# Altium schematic sheet 3_MCU_Main.SchDoc: OBDH MCU Main
size A3; DrawnBy: Sara Vega /Matheus Frata; Revision: V2.1; SheetNumber: 3; SheetTotal: 7
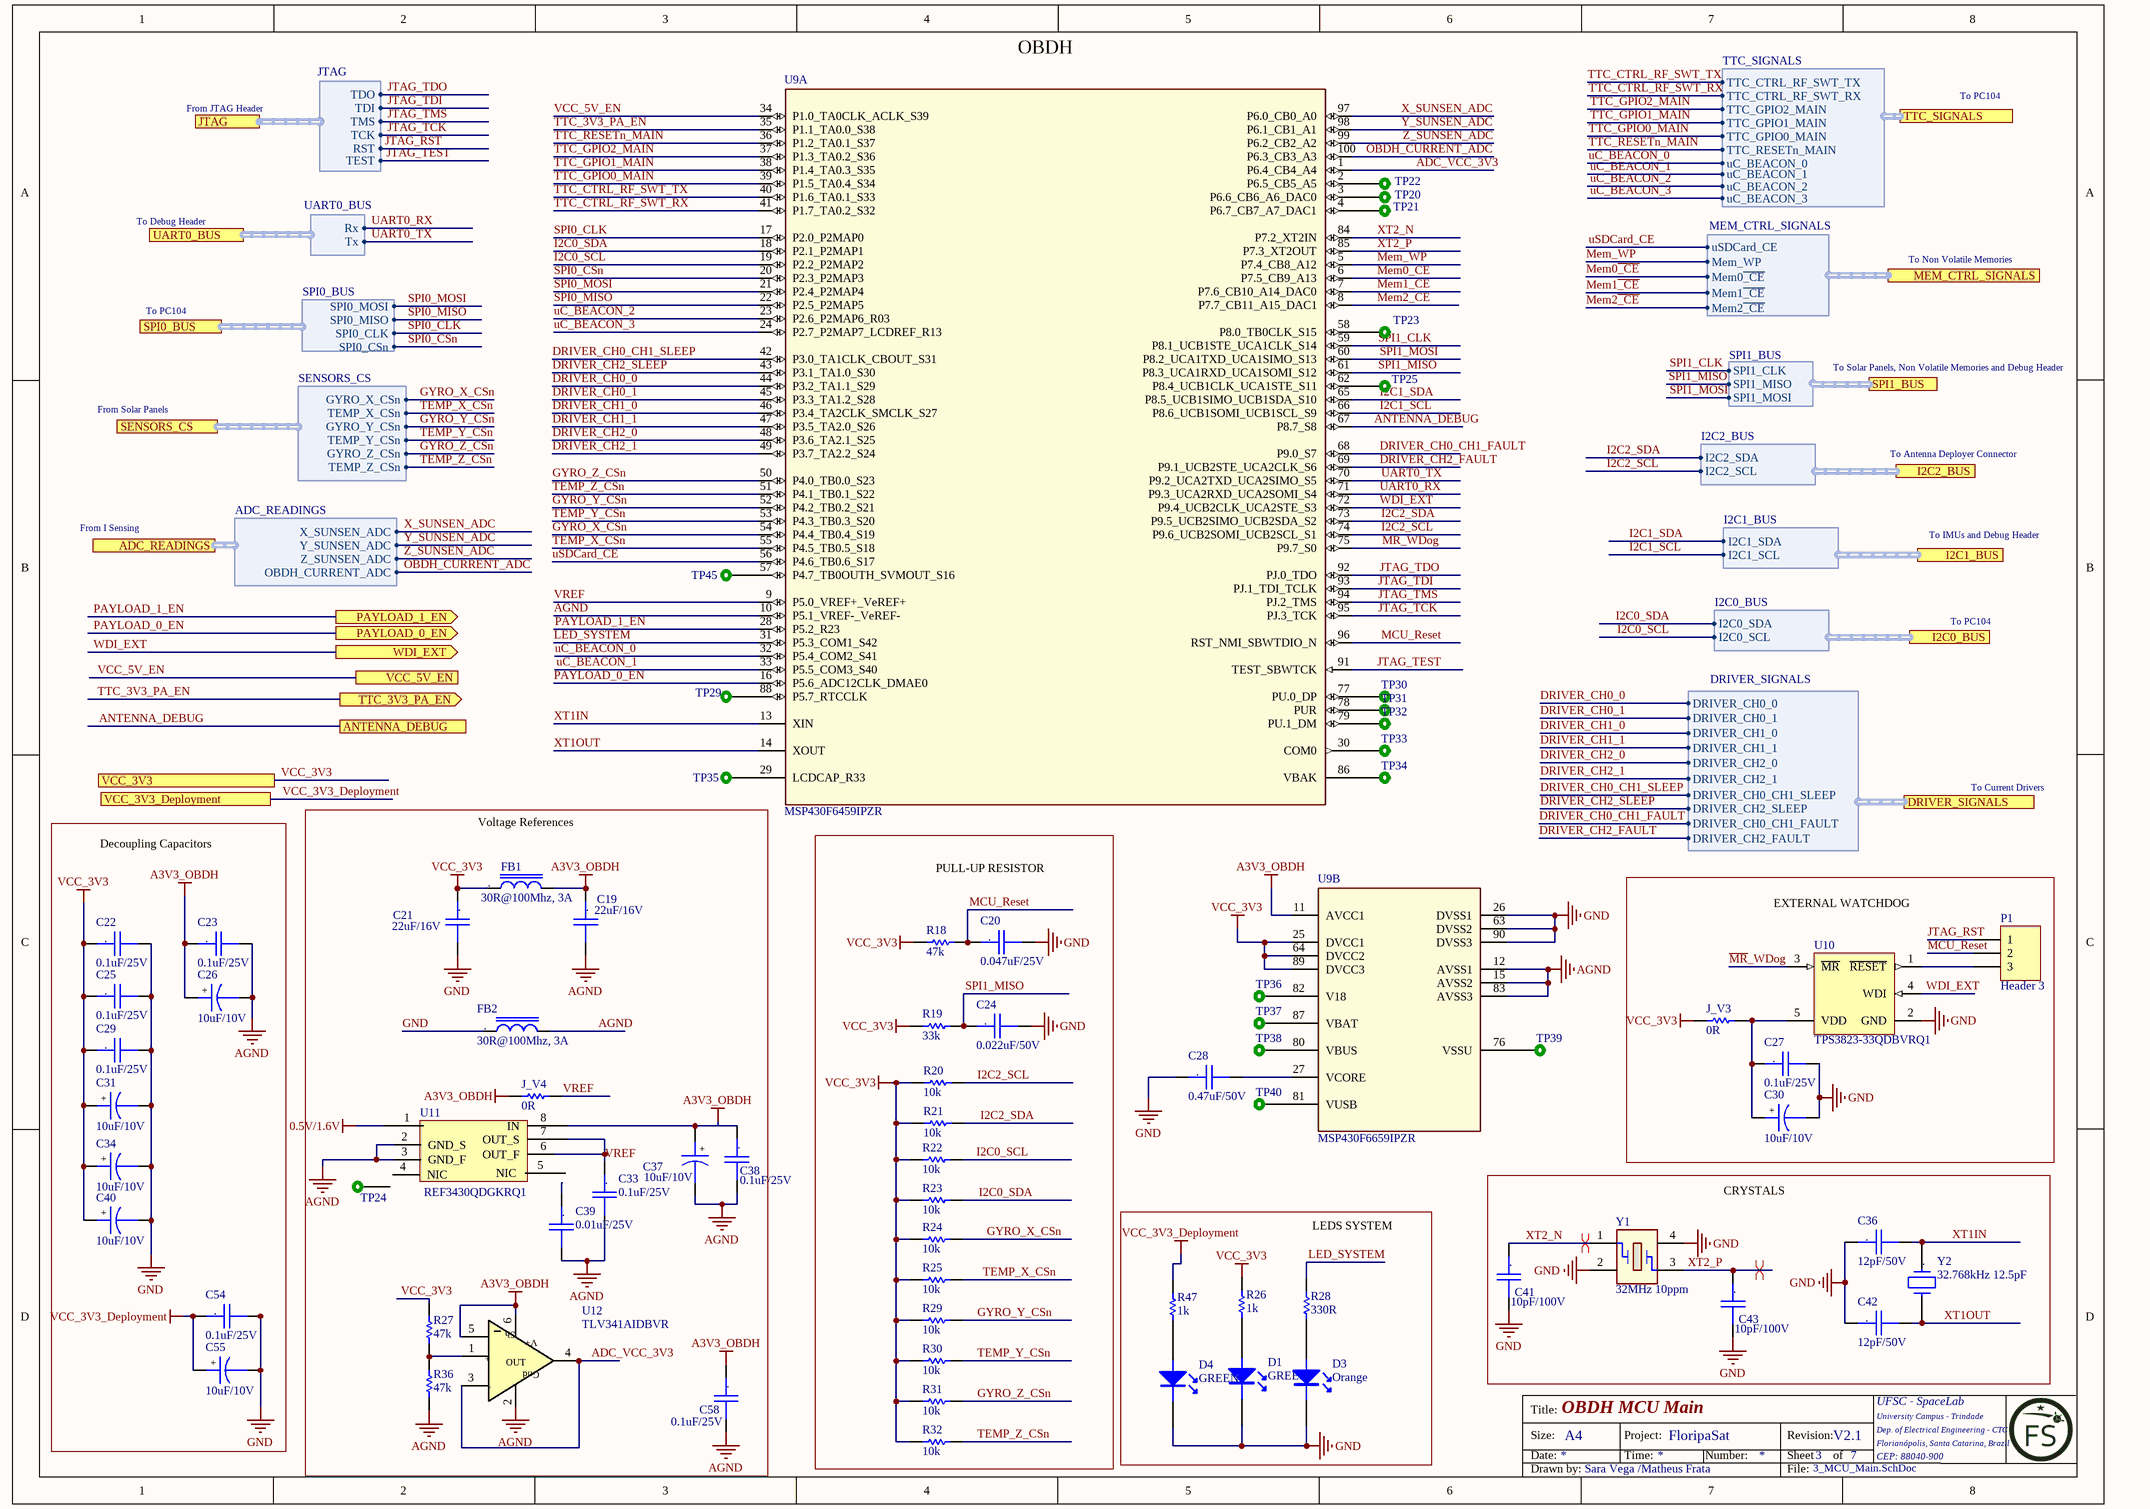
[diagram p0: 3_MCU_Main.SchDoc]

## Parts
C19  22uF/16V  [CC1210]
C20  0.047uF/25V  [CC0805]
C21  22uF/16V  [CC1210]
C22  0.1uF/25V  [CC0805]
C23  0.1uF/25V  [CC0805]
C24  0.022uF/50V  [CC0805]
C25  0.1uF/25V  [CC0805]
C26  10uF/10V  [CC0805_Tantalum]
C27  0.1uF/25V  [CC0805]
C28  0.47uF/50V  [CC0805]
C29  0.1uF/25V  [CC0805]
C30  10uF/10V  [CC0805_Tantalum]
C31  10uF/10V  [CC0805_Tantalum]
C33  0.1uF/25V  [CC0805]
C34  10uF/10V  [CC0805_Tantalum]
C36  12pF/50V  [CC0805]
C37  10uF/10V  [CC0805_Tantalum]
C38  0.1uF/25V  [CC0805]
C39  0.01uF/25V  [CC0805]
C40  10uF/10V  [CC0805_Tantalum]
C41  10pF/100V  [CC0805]
C42  12pF/50V  [CC0805]
C43  10pF/100V  [CC0805]
C54  0.1uF/25V  [CC0805]
C55  10uF/10V  [CC0805_Tantalum]
C58  0.1uF/25V  [CC0805]
D1  GREEN  [0805-LED]
D3  Orange  [0805-LED]
D4  GREEN  [0805-LED]
FB1  30R@100Mhz, 3A  [IND0805]
FB2  30R@100Mhz, 3A  [IND0805]
J_V3  0R  [0805]
J_V4  0R  [0805]
P1  Header 3  [HDR1X3]
R18  47k  [0805]
R19  33k  [0805]
R20  10k  [0805]
R21  10k  [0805]
R22  10k  [0805]
R23  10k  [0805]
R24  10k  [0805]
R25  10k  [0805]
R26  1k  [0805]
R27  47k  [0805]
R28  330R  [0805]
R29  10k  [0805]
R30  10k  [0805]
R31  10k  [0805]
R32  10k  [0805]
R36  47k  [0805]
R47  1k  [0805]
TP20  TEST_POINT_2  [TEST_POINT_2]  (value not drawn)  (no BOM)
TP21  TEST_POINT_2  [TEST_POINT_2]  (value not drawn)  (no BOM)
TP22  TEST_POINT_2  [TEST_POINT_2]  (value not drawn)  (no BOM)
TP23  TEST_POINT_2  [TEST_POINT_2]  (value not drawn)  (no BOM)
TP24  TEST_POINT_2  [TEST_POINT_2]  (value not drawn)  (no BOM)
TP25  TEST_POINT_2  [TEST_POINT_2]  (value not drawn)  (no BOM)
TP29  TEST_POINT_2  [TEST_POINT_2]  (value not drawn)  (no BOM)
TP30  TEST_POINT_2  [TEST_POINT_2]  (value not drawn)  (no BOM)
TP31  TEST_POINT_2  [TEST_POINT_2]  (value not drawn)  (no BOM)
TP32  TEST_POINT_2  [TEST_POINT_2]  (value not drawn)  (no BOM)
TP33  TEST_POINT_2  [TEST_POINT_2]  (value not drawn)  (no BOM)
TP34  TEST_POINT_2  [TEST_POINT_2]  (value not drawn)  (no BOM)
TP35  TEST_POINT_2  [TEST_POINT_2]  (value not drawn)  (no BOM)
TP36  TEST_POINT_2  [TEST_POINT_2]  (value not drawn)  (no BOM)
TP37  TEST_POINT_2  [TEST_POINT_2]  (value not drawn)  (no BOM)
TP38  TEST_POINT_2  [TEST_POINT_2]  (value not drawn)  (no BOM)
TP39  TEST_POINT_2  [TEST_POINT_2]  (value not drawn)  (no BOM)
TP40  TEST_POINT_2  [TEST_POINT_2]  (value not drawn)  (no BOM)
TP45  TEST_POINT_2  [TEST_POINT_2]  (value not drawn)  (no BOM)
U9  MSP430F6459IPZR  [PZ0100A_N]  (parts A,B of 2)
U10  TPS3823-33QDBVRQ1  [DBV0005A_N]
U11  REF3430QDGKRQ1  [SOIC-8]
U12  TLV341AIDBVR  [SOT-23 6L]
Y1  32MHz 10ppm  [XTAL_ABM8X]
Y2  32.768kHz 12.5pF  [ABS06 0805]

## Blocks framed on the sheet
Decoupling Capacitors: C22 C23 C25 C26 C29 C31 C34 C40 C54 C55
Voltage References: C19 C21 C33 C37-C39 C58 FB1 FB2 J_V4 R27 R36 TP24 U11 U12
PULL-UP RESISTOR: C20 C24 R18-R25 R29-R32
EXTERNAL WATCHDOG: C27 C30 J_V3 P1 U10
CRYSTALS: C36 C41-C43 Y1 Y2
LEDS SYSTEM: D1 D3 D4 R26 R28 R47

## Ports
ADC_READINGS (harness ADC_READINGS), ANTENNA_DEBUG, DRIVER_SIGNALS (harness DRIVER_SIGNALS), I2C0_BUS (harness I2C0_BUS), I2C1_BUS (harness I2C1_BUS), I2C2_BUS (harness I2C2_BUS), JTAG (harness JTAG), MEM_CTRL_SIGNALS (harness MEM_CTRL_SIGNALS), PAYLOAD_0_EN (out), PAYLOAD_1_EN (out), SENSORS_CS (harness SENSORS_CS), SPI0_BUS (harness SPI0_BUS), SPI1_BUS (harness SPI1_BUS), TTC_3V3_PA_EN (out), TTC_SIGNALS (harness TTC_SIGNALS), UART0_BUS (harness UART0_BUS), VCC_3V3, VCC_3V3_Deployment, VCC_5V_EN, WDI_EXT (out)

## Harnesses
JTAG: TDO, TDI, TMS, TCK, RST, TEST
UART0_BUS: Rx, Tx
I2C1_BUS: I2C1_SCL, I2C1_SDA
SENSORS_CS: GYRO_X_CSn, TEMP_X_CSn, GYRO_Y_CSn, TEMP_Y_CSn, GYRO_Z_CSn, TEMP_Z_CSn
I2C0_BUS: I2C0_SCL, I2C0_SDA
I2C2_BUS: I2C2_SCL, I2C2_SDA
DRIVER_SIGNALS: DRIVER_CH0_CH1_SLEEP, DRIVER_CH2_SLEEP, DRIVER_CH0_CH1_FAULT, DRIVER_CH2_FAULT, DRIVER_CH2_1, DRIVER_CH2_0, DRIVER_CH1_1, DRIVER_CH1_0, DRIVER_CH0_1, DRIVER_CH0_0
TTC_SIGNALS: TTC_RESETn_MAIN, TTC_GPIO0_MAIN, TTC_GPIO1_MAIN, TTC_GPIO2_MAIN, TTC_CTRL_RF_SWT_RX, TTC_CTRL_RF_SWT_TX, uC_BEACON_0, uC_BEACON_1, uC_BEACON_2, uC_BEACON_3
ADC_READINGS: OBDH_CURRENT_ADC, Z_SUNSEN_ADC, Y_SUNSEN_ADC, X_SUNSEN_ADC
MEM_CTRL_SIGNALS: Mem2~{_CE}, Mem1~{_CE}, Mem0~{_CE}, Mem_WP, uSDCard_CE
SPI0_BUS: SPI0_CLK, SPI0_MISO, SPI0_MOSI, SPI0_CSn
SPI1_BUS: SPI1_CLK, SPI1_MISO, SPI1_MOSI

## Nets
0.5V/1.6V: U11.1
A3V3_OBDH: C19.1 C23.1 C26.1 C58.1 FB1.2 J_V4.2 U9.11(AVCC1) U12.5(EN) U12.6(V+)
AGND: C19.2 C23.2 C26.2 C33.2 C37.2 C38.2 C39.2 C58.2 FB2.2 R36.2 U9.10(P5.1_VREF-_VeREF-) U9.12(AVSS1) U9.15(AVSS2) U9.83(AVSS3) U11.2(GND_S) U11.3(GND_F) U12.2(Gnd)
GND: C20.2 C21.2 C22.2 C24.2 C25.2 C27.2 C28.1 C29.2 C30.2 C31.2 C34.2 C36.1 C40.2 C41.2 C42.1 C43.2 C54.2 C55.2 D1.2(K) D3.2(K) D4.2(K) FB2.1 U9.26(DVSS1) U9.63(DVSS2) U9.90(DVSS3) U10.2(GND) Y1.2 Y1.4
VCC_3V3: C21.1 C22.1 C25.1 C29.1 C31.1 C34.1 C40.1 FB1.1 J_V3.2 R18.2 R19.2 R20.2 R21.2 R22.2 R23.2 R24.2 R25.2 R26.2 R27.1 R29.2 R30.2 R31.2 R32.2 U9.25(DVCC1) U9.64(DVCC2) U9.89(DVCC3) ; port VCC_3V3
VCC_3V3_Deployment: C54.1 C55.1 R47.2 ; port VCC_3V3_Deployment
~{MR}_WDog: U9.75(P9.7_S0) U10.3(~{MR})
ADC_VCC_3V3: U9.1(P6.4_CB4_A4) U12.3(-IN) U12.4(OUT)
ANTENNA_DEBUG: U9.67(P8.7_S8) ; port ANTENNA_DEBUG
DRIVER_CH0_0: U9.44(P3.2_TA1.1_S29) ; port DRIVER_SIGNALS.DRIVER_CH0_0
DRIVER_CH0_1: U9.45(P3.3_TA1.2_S28) ; port DRIVER_SIGNALS.DRIVER_CH0_1
DRIVER_CH0_CH1_FAULT: U9.68(P9.0_S7) ; port DRIVER_SIGNALS.DRIVER_CH0_CH1_FAULT
DRIVER_CH0_CH1_SLEEP: U9.42(P3.0_TA1CLK_CBOUT_S31) ; port DRIVER_SIGNALS.DRIVER_CH0_CH1_SLEEP
DRIVER_CH1_0: U9.46(P3.4_TA2CLK_SMCLK_S27) ; port DRIVER_SIGNALS.DRIVER_CH1_0
DRIVER_CH1_1: U9.47(P3.5_TA2.0_S26) ; port DRIVER_SIGNALS.DRIVER_CH1_1
DRIVER_CH2_0: U9.48(P3.6_TA2.1_S25) ; port DRIVER_SIGNALS.DRIVER_CH2_0
DRIVER_CH2_1: U9.49(P3.7_TA2.2_S24) ; port DRIVER_SIGNALS.DRIVER_CH2_1
DRIVER_CH2_FAULT: U9.69(P9.1_UCB2STE_UCA2CLK_S6) ; port DRIVER_SIGNALS.DRIVER_CH2_FAULT
DRIVER_CH2_SLEEP: U9.43(P3.1_TA1.0_S30) ; port DRIVER_SIGNALS.DRIVER_CH2_SLEEP
GYRO_X_CSn: R24.1 U9.54(P4.4_TB0.4_S19) ; port SENSORS_CS.GYRO_X_CSn
GYRO_Y_CSn: R29.1 U9.52(P4.2_TB0.2_S21) ; port SENSORS_CS.GYRO_Y_CSn
GYRO_Z_CSn: R31.1 U9.50(P4.0_TB0.0_S23) ; port SENSORS_CS.GYRO_Z_CSn
I2C0_SCL: R22.1 U9.19(P2.2_P2MAP2) ; port I2C0_BUS.I2C0_SCL
I2C0_SDA: R23.1 U9.18(P2.1_P2MAP1) ; port I2C0_BUS.I2C0_SDA
I2C1_SCL: U9.66(P8.6_UCB1SOMI_UCB1SCL_S9) ; port I2C1_BUS.I2C1_SCL
I2C1_SDA: U9.65(P8.5_UCB1SIMO_UCB1SDA_S10) ; port I2C1_BUS.I2C1_SDA
I2C2_SCL: R20.1 U9.74(P9.6_UCB2SOMI_UCB2SCL_S1) ; port I2C2_BUS.I2C2_SCL
I2C2_SDA: R21.1 U9.73(P9.5_UCB2SIMO_UCB2SDA_S2) ; port I2C2_BUS.I2C2_SDA
JTAG_RST: P1.1 ; port JTAG.RST
JTAG_TCK: U9.95(PJ.3_TCK) ; port JTAG.TCK
JTAG_TDI: U9.93(PJ.1_TDI_TCLK) ; port JTAG.TDI
JTAG_TDO: U9.92(PJ.0_TDO) ; port JTAG.TDO
JTAG_TEST: U9.91(TEST_SBWTCK) ; port JTAG.TEST
JTAG_TMS: U9.94(PJ.2_TMS) ; port JTAG.TMS
LED_SYSTEM: R28.1 U9.31(P5.3_COM1_S42)
MCU_Reset: C20.1 P1.2 R18.1 U9.96(RST_NMI_SBWTDIO_N)
Mem0~{_CE}: U9.6(P7.5_CB9_A13) ; port MEM_CTRL_SIGNALS.Mem0~{_CE}
Mem1~{_CE}: U9.7(P7.6_CB10_A14_DAC0) ; port MEM_CTRL_SIGNALS.Mem1~{_CE}
Mem2~{_CE}: U9.8(P7.7_CB11_A15_DAC1) ; port MEM_CTRL_SIGNALS.Mem2~{_CE}
Mem_WP: U9.5(P7.4_CB8_A12) ; port MEM_CTRL_SIGNALS.Mem_WP
OBDH_CURRENT_ADC: U9.100(P6.3_CB3_A3) ; port ADC_READINGS.OBDH_CURRENT_ADC
PAYLOAD_0_EN: U9.16(P5.6_ADC12CLK_DMAE0) ; port PAYLOAD_0_EN
PAYLOAD_1_EN: U9.28(P5.2_R23) ; port PAYLOAD_1_EN
SPI0_CLK: U9.17(P2.0_P2MAP0) ; port SPI0_BUS.SPI0_CLK
SPI0_CSn: U9.20(P2.3_P2MAP3) ; port SPI0_BUS.SPI0_CSn
SPI0_MISO: U9.22(P2.5_P2MAP5) ; port SPI0_BUS.SPI0_MISO
SPI0_MOSI: U9.21(P2.4_P2MAP4) ; port SPI0_BUS.SPI0_MOSI
SPI1_CLK: U9.59(P8.1_UCB1STE_UCA1CLK_S14) ; port SPI1_BUS.SPI1_CLK
SPI1_MISO: C24.1 R19.1 U9.61(P8.3_UCA1RXD_UCA1SOMI_S12) ; port SPI1_BUS.SPI1_MISO
SPI1_MOSI: U9.60(P8.2_UCA1TXD_UCA1SIMO_S13) ; port SPI1_BUS.SPI1_MOSI
TEMP_X_CSn: R25.1 U9.55(P4.5_TB0.5_S18) ; port SENSORS_CS.TEMP_X_CSn
TEMP_Y_CSn: R30.1 U9.53(P4.3_TB0.3_S20) ; port SENSORS_CS.TEMP_Y_CSn
TEMP_Z_CSn: R32.1 U9.51(P4.1_TB0.1_S22) ; port SENSORS_CS.TEMP_Z_CSn
TTC_3V3_PA_EN: U9.35(P1.1_TA0.0_S38) ; port TTC_3V3_PA_EN
TTC_CTRL_RF_SWT_RX: U9.41(P1.7_TA0.2_S32) ; port TTC_SIGNALS.TTC_CTRL_RF_SWT_RX
TTC_CTRL_RF_SWT_TX: U9.40(P1.6_TA0.1_S33) ; port TTC_SIGNALS.TTC_CTRL_RF_SWT_TX
TTC_GPIO0_MAIN: U9.39(P1.5_TA0.4_S34) ; port TTC_SIGNALS.TTC_GPIO0_MAIN
TTC_GPIO1_MAIN: U9.38(P1.4_TA0.3_S35) ; port TTC_SIGNALS.TTC_GPIO1_MAIN
TTC_GPIO2_MAIN: U9.37(P1.3_TA0.2_S36) ; port TTC_SIGNALS.TTC_GPIO2_MAIN
TTC_RESETn_MAIN: U9.36(P1.2_TA0.1_S37) ; port TTC_SIGNALS.TTC_RESETn_MAIN
UART0_RX: U9.71(P9.3_UCA2RXD_UCA2SOMI_S4) ; port UART0_BUS.Rx
UART0_TX: U9.70(P9.2_UCA2TXD_UCA2SIMO_S5) ; port UART0_BUS.Tx
uC_BEACON_0: U9.32(P5.4_COM2_S41) ; port TTC_SIGNALS.uC_BEACON_0
uC_BEACON_1: U9.33(P5.5_COM3_S40) ; port TTC_SIGNALS.uC_BEACON_1
uC_BEACON_2: U9.23(P2.6_P2MAP6_R03) ; port TTC_SIGNALS.uC_BEACON_2
uC_BEACON_3: U9.24(P2.7_P2MAP7_LCDREF_R13) ; port TTC_SIGNALS.uC_BEACON_3
uSDCard_CE: U9.56(P4.6_TB0.6_S17) ; port MEM_CTRL_SIGNALS.uSDCard_CE
VCC_5V_EN: U9.34(P1.0_TA0CLK_ACLK_S39) ; port VCC_5V_EN
VREF: C33.1 J_V4.1 U9.9(P5.0_VREF+_VeREF+) U11.6(OUT_F) U11.7(OUT_S)
WDI_EXT: U9.72(P9.4_UCB2CLK_UCA2STE_S3) U10.4(WDI) ; port WDI_EXT
X_SUNSEN_ADC: U9.97(P6.0_CB0_A0) ; port ADC_READINGS.X_SUNSEN_ADC
XT1IN: C36.2 U9.13(XIN) Y2.1
XT1OUT: C42.2 U9.14(XOUT) Y2.2
XT2_N: C41.1 U9.84(P7.2_XT2IN) Y1.1
XT2_P: C43.1 U9.85(P7.3_XT2OUT) Y1.3
Y_SUNSEN_ADC: U9.98(P6.1_CB1_A1) ; port ADC_READINGS.Y_SUNSEN_ADC
Z_SUNSEN_ADC: U9.99(P6.2_CB2_A2) ; port ADC_READINGS.Z_SUNSEN_ADC
NetC27_1: C27.1 C30.1 J_V3.1 U10.5(VDD)
NetC28_2: C28.2 U9.27(VCORE)
NetC37_1: C37.1 C38.1 U11.8(IN)
NetD1_1: D1.1(A) R26.1
NetD3_1: D3.1(A) R28.2
NetD4_1: D4.1(A) R47.1
NetP1_3: P1.3 U10.1(~{RESET})
NetR27_2: R27.2 R36.1 U12.1(+IN)
NetTP20_1: TP20.1 U9.3(P6.6_CB6_A6_DAC0)
NetTP21_1: TP21.1 U9.4(P6.7_CB7_A7_DAC1)
NetTP22_1: TP22.1 U9.2(P6.5_CB5_A5)
NetTP23_1: TP23.1 U9.58(P8.0_TB0CLK_S15)
NetTP25_1: TP25.1 U9.62(P8.4_UCB1CLK_UCA1STE_S11)
NetTP29_1: TP29.1 U9.88(P5.7_RTCCLK)
NetTP30_1: TP30.1 U9.77(PU.0_DP)
NetTP31_1: TP31.1 U9.78(PUR)
NetTP32_1: TP32.1 U9.79(PU.1_DM)
NetTP33_1: TP33.1 U9.30(COM0)
NetTP34_1: TP34.1 U9.86(VBAK)
NetTP35_1: TP35.1 U9.29(LCDCAP_R33)
NetTP36_1: TP36.1 U9.82(V18)
NetTP37_1: TP37.1 U9.87(VBAT)
NetTP38_1: TP38.1 U9.80(VBUS)
NetTP39_1: TP39.1 U9.76(VSSU)
NetTP40_1: TP40.1 U9.81(VUSB)
NetTP45_1: TP45.1 U9.57(P4.7_TB0OUTH_SVMOUT_S16)

Not connected (* = marked no-connect by the designer): C39 1; TP24 1; U11 4(NIC) 5(NIC)

## Layout directives
differential pair: XT2_N, XT2_P

## Notes on the sheet
- From JTAG Header
- OBDH
- To PC104
- To Debug Header
- To Non Volatile Memories
- To Solar Panels, Non Volatile Memories and Debug Header
- From Solar Panels
- To Antenna Deployer Connector
- From I Sensing
- To IMUs and Debug Header
- To Current Drivers
- Title:
- Size:
- Date:
- A4
- Project:
- Time:
- FloripaSat
- Number:
- Revision:
- Sheet
- of
- UFSC - SpaceLab
- University Campus - Trindade
- Dep. of Electrical Engineering - CTC
- Florianópolis, Santa Catarina, Brazil
- CEP: 88040-900
- Drawn by:
- File:
- (in symbol Cap_Cer_X7R_0.01uF_16V_1210) .
- (in symbol Cap_Cer_X7R_0.1uF_25V_0805) .
- (in symbol Cap_Cer_X7R_0.01uF_50V_0805) .
- (in symbol Cap_Cer_X7R_0.022uF_50V_0805) .
- (in symbol Cap_Cer_X7R_0.47uF_50V_0805) .
- (in symbol Cap_Cer_X7R_10pF_100V_0805) .
- (in symbol Cap_Cer_X7R_12pF_50V_0805) .
- (in symbol Cap_Tant_SMD_10uF_6V3_0805) +
- (in symbol FB_30R_3A_100MHz_0805) .
- (in symbol TLV341AIDBVR) Sh; +; -
- (in symbol Xtal_32.768kHz_12pF_2_SMD) .

## Library data of the parts
C19 C21 = Cap_Cer_X7R_0.01uF_16V_1210: CAP CER 22uF 16V 10% X7R 1210; Partnumber: C3225X7R1C226K250AC; NCM: 8532.24.10
C20 = Cap_Cer_X7R_0.022uF_50V_0805: CAP CER 0.047UF 25V 5% X7R 0805; Partnumber: C0805C473J3GACTU; NCM: 8532.24.10
C22 C23 C25 C27 C29 C33 C38 C54 C58 = Cap_Cer_X7R_0.1uF_25V_0805: CAP CER 0.1UF 25V 10% X7R 0805; Partnumber: CC0805KRX7R8BB104; NCM: 8532.24.10
C24 = Cap_Cer_X7R_0.022uF_50V_0805: CAP CER 0.022UF 50V 5% X7R 0805; Partnumber: CGA4J2C0G1H223J125AA; NCM: 8532.24.10
C26 C30 C31 C34 C37 C40 C55 = Cap_Tant_SMD_10uF_6V3_0805: CAP Tantalum 10uF 6.3V 10% 0805; Partnumber: TPSR106K006R1000; NCM: 8532.21.11
C28 = Cap_Cer_X7R_0.47uF_50V_0805: CAP CER 0.47UF 50V 10% X7R 0805; Partnumber: C0805C474K5RACTU; NCM: 8532.24.10
C36 C42 = Cap_Cer_X7R_12pF_50V_0805: CAP CER 12pF 50V 0805; Partnumber: CL21C120FBANNNC; NCM: 8532.24.10
C39 = Cap_Cer_X7R_0.01uF_50V_0805: CAP CER 0.01uF 25V 10% X7R 0805; Partnumber: CL21B103KAANNNC; NCM: 8532.24.10
C41 C43 = Cap_Cer_X7R_10pF_100V_0805: CAP CER 10pF 100V 0805; Partnumber: 08051A100FAT2A; NCM: 8532.24.10
D1 D4 = LED/G_0805: SMD Green LED; Partnumber: LTST-C171GKT; NCM: 8541.40.21
D3 = LED/R_0603: SMD Orange LED; Partnumber: LTST-C170KFKT; NCM: 8541.40.21
FB1 FB2 = FB_30R_3A_100MHz_0805: Ferrite Bead 30 OHM 3A 100MHz; Partnumber: BLM21PG300SN1D; NCM: 8504.50.00
J_V3 J_V4 = R0R_JUMPER_1/16W_0805: RES 0R OHM 1/16W JUMPER 0805; Partnumber: CRCW08050000Z0EA; NCM: 8533.21.20
P1 = Header 3: Header, 3-Pin; LatestRevisionDate: 17-Jul-2002; LatestRevisionNote: Re-released for DXP Platform.; Publisher: Altium Limited
R18 R27 R36 = R27_5%_1/10W_0805: RES 47k OHM 1/10W 1% 0805; Partnumber: RC0805FR-0747KL; NCM: 8533.21.20
R19 = R33k_1%_1/10W_0805: RES 33K OHM 1/10W 1% 0805; Partnumber: RC0805FR-0733KL; NCM: 8533.21.20
R20-R25 R29-R32 = R10k_1%_1/8W_0805: RES 10K OHM 1/8W 1%  0805; Partnumber: CRCW080510K0FKEA; NCM: 8533.21.20
R26 R47 = R1.0k_1%_1/8W_0805: RES 1.0K OHM 1/8W 1% 0805; Partnumber: RC0805FR-071KL; NCM: 8533.21.20
R28 = R330R_1%_1/4W_0805: RES 330R OHM 1/4W 1% 0805; Partnumber: RC0805FR-07330RL; NCM: 8533.21.20
TP20-TP25 TP29-TP40 TP45 = TEST_POINT_2: Test point
U9 = MSP430F6659IPZR: Imported; Manufacturer: Texas Instruments; CompType: IC; PIN_COUNT: 100; Application_BuildNumber: *; PartNumber: MSP430F6659IPZR; Alternate PartNumber: MSP430F6659IPZ; PackageReference: PZ0100A; MountType: SMT; RoHS: Y; RefDes: RefDes; Type: DEV; Value: Value
U10 = CMP-0338-00011-2: Processor Supervisory Circuit, 1 Supply Monitored, -40 to 85 degC, 5-Pin SOT-23 (DBV), Green (RoHS & no Sb/Br); Manufacturer: Texas Instruments; Iq: 15 uA Typ.; Threshold Voltage: 2.93 V Typ.; Watchdog Timer WDI: 0.2 s; VCC: 1.1 V Min.; Reset Threshold Accuracy: 2.4%; Rating: Catalog; Time Delay: 25 ms; # of Supplies Monitored: 1; Output Driver Type / Reset Output: Active-low, Push-pull; Packing: Tape and Reel; ComponentLink1Description: Manufacturer URL; RoHS: TRUE; PackageDescription: 5-Pin Plastic Small Outline, Body 1.6 x 2.9 mm, Pitch 0.95 mm; Mounting Technology: Surface Mount; ComponentLink1URL: www.ti.com; PackageReference: DBV0005A; ComponentLink3URL: http://www.ti.com/lit/ml/mpds018j/mpds018j.pdf; ComponentLink3Description: Package Specification; PartNumber: TPS3823-33QDBVRQ1; DatasheetVersion: SLVS165J; ComponentLink2Description: Datasheet; PackageVersion: 4073253-4/L; ComponentLink2URL: http://www.ti.com/lit/ds/symlink/tps3820-33.pdf; Operating Temperature Range: -40 to 85 degC
U11 = REF5030A-Q1: Partnumber: REF3430QDGKRQ1
Y1 = XTAL_32MHz_SMD_4-SMD: 32MHz ±10ppm Crystal 10pF 60 Ohm -40°C ~ 125°C; Partnumber: ABM8X-102-32.000MHZ-T; NCM: 8541.60.10
Y2 = Xtal_32.768kHz_12pF_2_SMD: 32.768kHz ±20ppm Crystal 12.5pF 70 kOhm -40°C ~ 125°C; Partnumber: ECS-.327-12.5-34S-TR; NCM: 8541.60.10
U12 = TLV341AIDBVR: Partnumber: TLV341AIDBVR